# Altium schematic sheet BW1098OBC_ESP32.SchDoc
size A
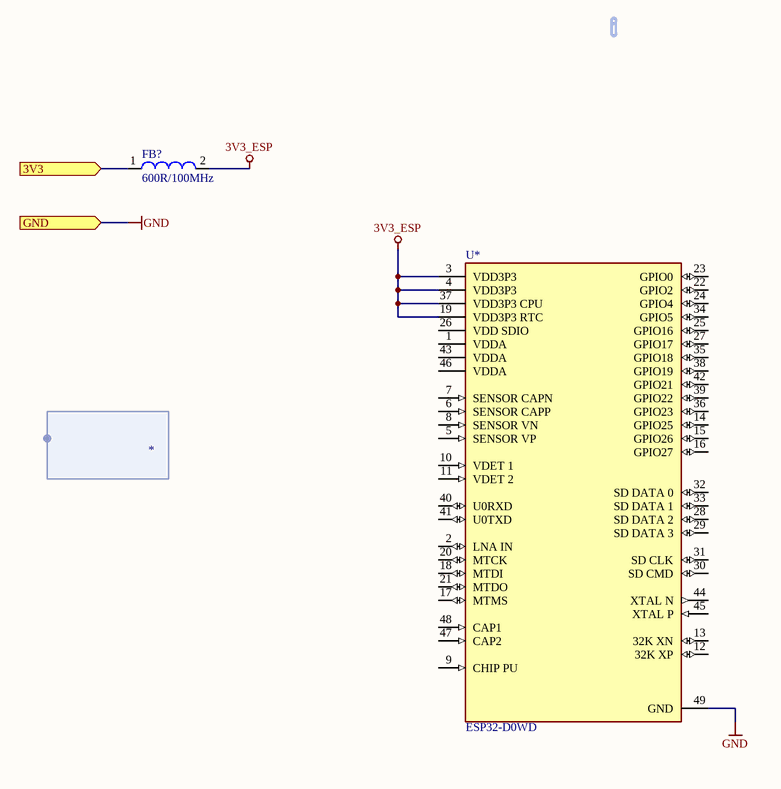
[diagram p0: BW1098OBC_ESP32.SchDoc]

## Parts
FB?  600R/100MHz  [2508056017Y2]
U*  ESP32-D0WD  [FP-ESP32-D0WD-IPC_A]

## Ports
3V3 (in), GND (in)

## Harnesses
*: 

## Nets
3V3_ESP: FB?.2 U*.3(VDD3P3) U*.4(VDD3P3) U*.19(VDD3P3_RTC) U*.37(VDD3P3_CPU)
GND: U*.49(GND) ; port GND
3V3: FB?.1 ; port 3V3

Not connected (* = marked no-connect by the designer): U* 1(VDDA) 2(LNA_IN) 5(SENSOR_VP) 6(SENSOR_CAPP) 7(SENSOR_CAPN) 8(SENSOR_VN) 9(CHIP_PU) 10(VDET_1) 11(VDET_2) 12(32K_XP) 13(32K_XN) 14(GPIO25) 15(GPIO26) 16(GPIO27) 17(MTMS) 18(MTDI) 20(MTCK) 21(MTDO) 22(GPIO2) 23(GPIO0) 24(GPIO4) 25(GPIO16) 26(VDD_SDIO) 27(GPIO17) 28(SD_DATA_2) 29(SD_DATA_3) 30(SD_CMD) 31(SD_CLK) 32(SD_DATA_0) 33(SD_DATA_1) 34(GPIO5) 35(GPIO18) 36(GPIO23) 38(GPIO19) 39(GPIO22) 40(U0RXD) 41(U0TXD) 42(GPIO21) 43(VDDA) 44(XTAL_N) 45(XTAL_P) 46(VDDA) 47(CAP2) 48(CAP1)

## Library data of the parts
FB? = 2508056017Y2: FERRITE BEAD, 0.1OHM, 2A, 0805, 600R/100MHz; Manufacturer 1: Fair-Rite; Impedance: 600R; Tolerance: 25%; Resistance: 350mR; DC Resistance (DCR): 100mR; Test Frequency: 100MHz; Supplier 1: Digi-Key; Manufacturer Part Number 1: 2508056017Y2; Stock 1: 100491; Pricing 1: 1=0.10000, 10=0.07900, 25=0.07120, 50=0.05240, 100=0.04520, 250=0.03568, 500=0.03014, 1000=0.02538 (USD); RoHS: Yes; Case/Package: 0805; Number of Pins: 2; Case Code (Metric): 2012; Case Code (Imperial): 0805; Min Operating Temperature: -55°C; Max Operating Temperature: 125°C; Package Quantity: 4000; Packaging: Tape and Reel; Max DC Current: 2A; Termination: SMD/SMT; Military Standard: Not; DC Current: 2A; Current Rating: 2A; Frequency: 100MHz; Length: 2mm; Height: 0.9mm; Width: 1.25mm; Depth: 1.25mm; Radiation Hardening: No; REACH SVHC: No SVHC; ComponentLink1URL: https://datasheet.ciiva.com/3854/3802508056017y2-3854245.pdf?src-supplier=Arrow; ComponentLink1Description: https://datasheet.ciiva.com/3854/3802508056017y2-3854245.pdf?src-supplier=Arrow; ComponentLink2URL: https://datasheet.ciiva.com/22735/652149-22735047.pdf?src-supplier=Element14; ComponentLink2Description: https://datasheet.ciiva.com/22735/652149-22735047.pdf?src-supplier=Element14; ComponentLink3URL: https://datasheet.ciiva.com/1127/26143-1127514.pdf?src-supplier=Farnell; ComponentLink3Description: https://datasheet.ciiva.com/1127/26143-1127514.pdf?src-supplier=Farnell; ComponentLink4URL: https://datasheet.ciiva.com/18090/getdatasheetpartid-212640-18090187.pdf?src-supplier=Verical; ComponentLink4Description: https://datasheet.ciiva.com/18090/getdatasheetpartid-212640-18090187.pdf?src-supplier=Verical; ComponentLink5URL: https://datasheet.ciiva.com/7620/26143-7620140.pdf?src-supplier=Element14; ComponentLink5Description: https://datasheet.ciiva.com/7620/26143-7620140.pdf?src-supplier=Element14; Supplier Part Number 1: 1934-1487-1-ND
U* = ESP32-D0WD: SMD IC ESP32-D0WD, Dual Core Mcu, Wifi & Bluetooth Combo, QFN48-PIN, 5*5MM; Manufacturer: Espressif Systems; Frequency: 2.4GHz; Data Rate: 150Mbps; Interface: I2C,SPI,UART; Sensitivity: -98dBm; Memory Size: 520KB; Current - Receiving: 100mA; Current - Transmitting: 240mA; Number of GPIO: 34; Supplier 1: Digi-Key; Manufacturer Part Number: ESP32-D0WD; RoHS: No; Stock 1: 6655; Pricing 1: 1=3.00000 (USD); Min Operating Temperature: -40°C; Max Operating Temperature: 125°C; Packaging: Tape and Reel; ComponentLink1URL: http://espressif.com/sites/default/files/documentation/esp32_datasheet_en.pdf?src-supplier=Digi-Key; ComponentLink1Description: http://espressif.com/sites/default/files/documentation/esp32_datasheet_en.pdf?src-supplier=Digi-Key; Supplier Part Number 1: 1904-1003-1-ND